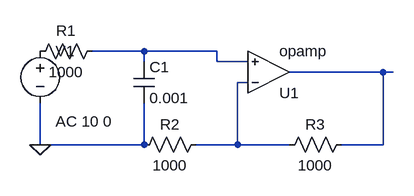
[diagram p0: schematic Draft14.asc]
Draft14.asc, the LTspice schematic file:
Version 4
SHEET 1 880 680
WIRE 208 64 128 64
WIRE 320 64 208 64
WIRE 208 80 208 64
WIRE 320 80 320 64
WIRE 368 80 320 80
WIRE 576 96 432 96
WIRE 592 96 576 96
WIRE 368 112 352 112
WIRE 48 208 48 144
WIRE 208 208 208 144
WIRE 208 208 48 208
WIRE 352 208 352 112
WIRE 352 208 288 208
WIRE 432 208 352 208
WIRE 576 208 576 96
WIRE 576 208 512 208
FLAG 48 208 0
SYMBOL res 144 48 R90
WINDOW 0 0 56 VBottom 2
WINDOW 3 32 56 VTop 2
SYMATTR InstName R1
SYMATTR Value 1000
SYMBOL res 304 192 R90
WINDOW 0 0 56 VBottom 2
WINDOW 3 32 56 VTop 2
SYMATTR InstName R2
SYMATTR Value 1000
SYMBOL res 528 192 R90
WINDOW 0 0 56 VBottom 2
WINDOW 3 32 56 VTop 2
SYMATTR InstName R3
SYMATTR Value 1000
SYMBOL cap 192 80 R0
SYMATTR InstName C1
SYMATTR Value 0.001
SYMBOL Opamps\\opamp 400 160 M180
SYMATTR InstName U1
SYMBOL voltage 48 48 R0
WINDOW 123 24 124 Left 2
WINDOW 39 0 0 Left 0
SYMATTR InstName V1
SYMATTR Value ""
SYMATTR Value2 AC 10 0

The netlist it stands for:
* Draft14.asc
R1 N001 P001 1000
R2 N003 0 1000
R3 N002 N003 1000
C1 N001 0 0.001
XU1 N003 N001 N002 opamp Aol=100K GBW=10Meg  ; pins invin noninvin out
V1 P001 0 AC 10 0
.backanno
.end